# EAGLE design untitled2 (EAGLE 8.2.2)
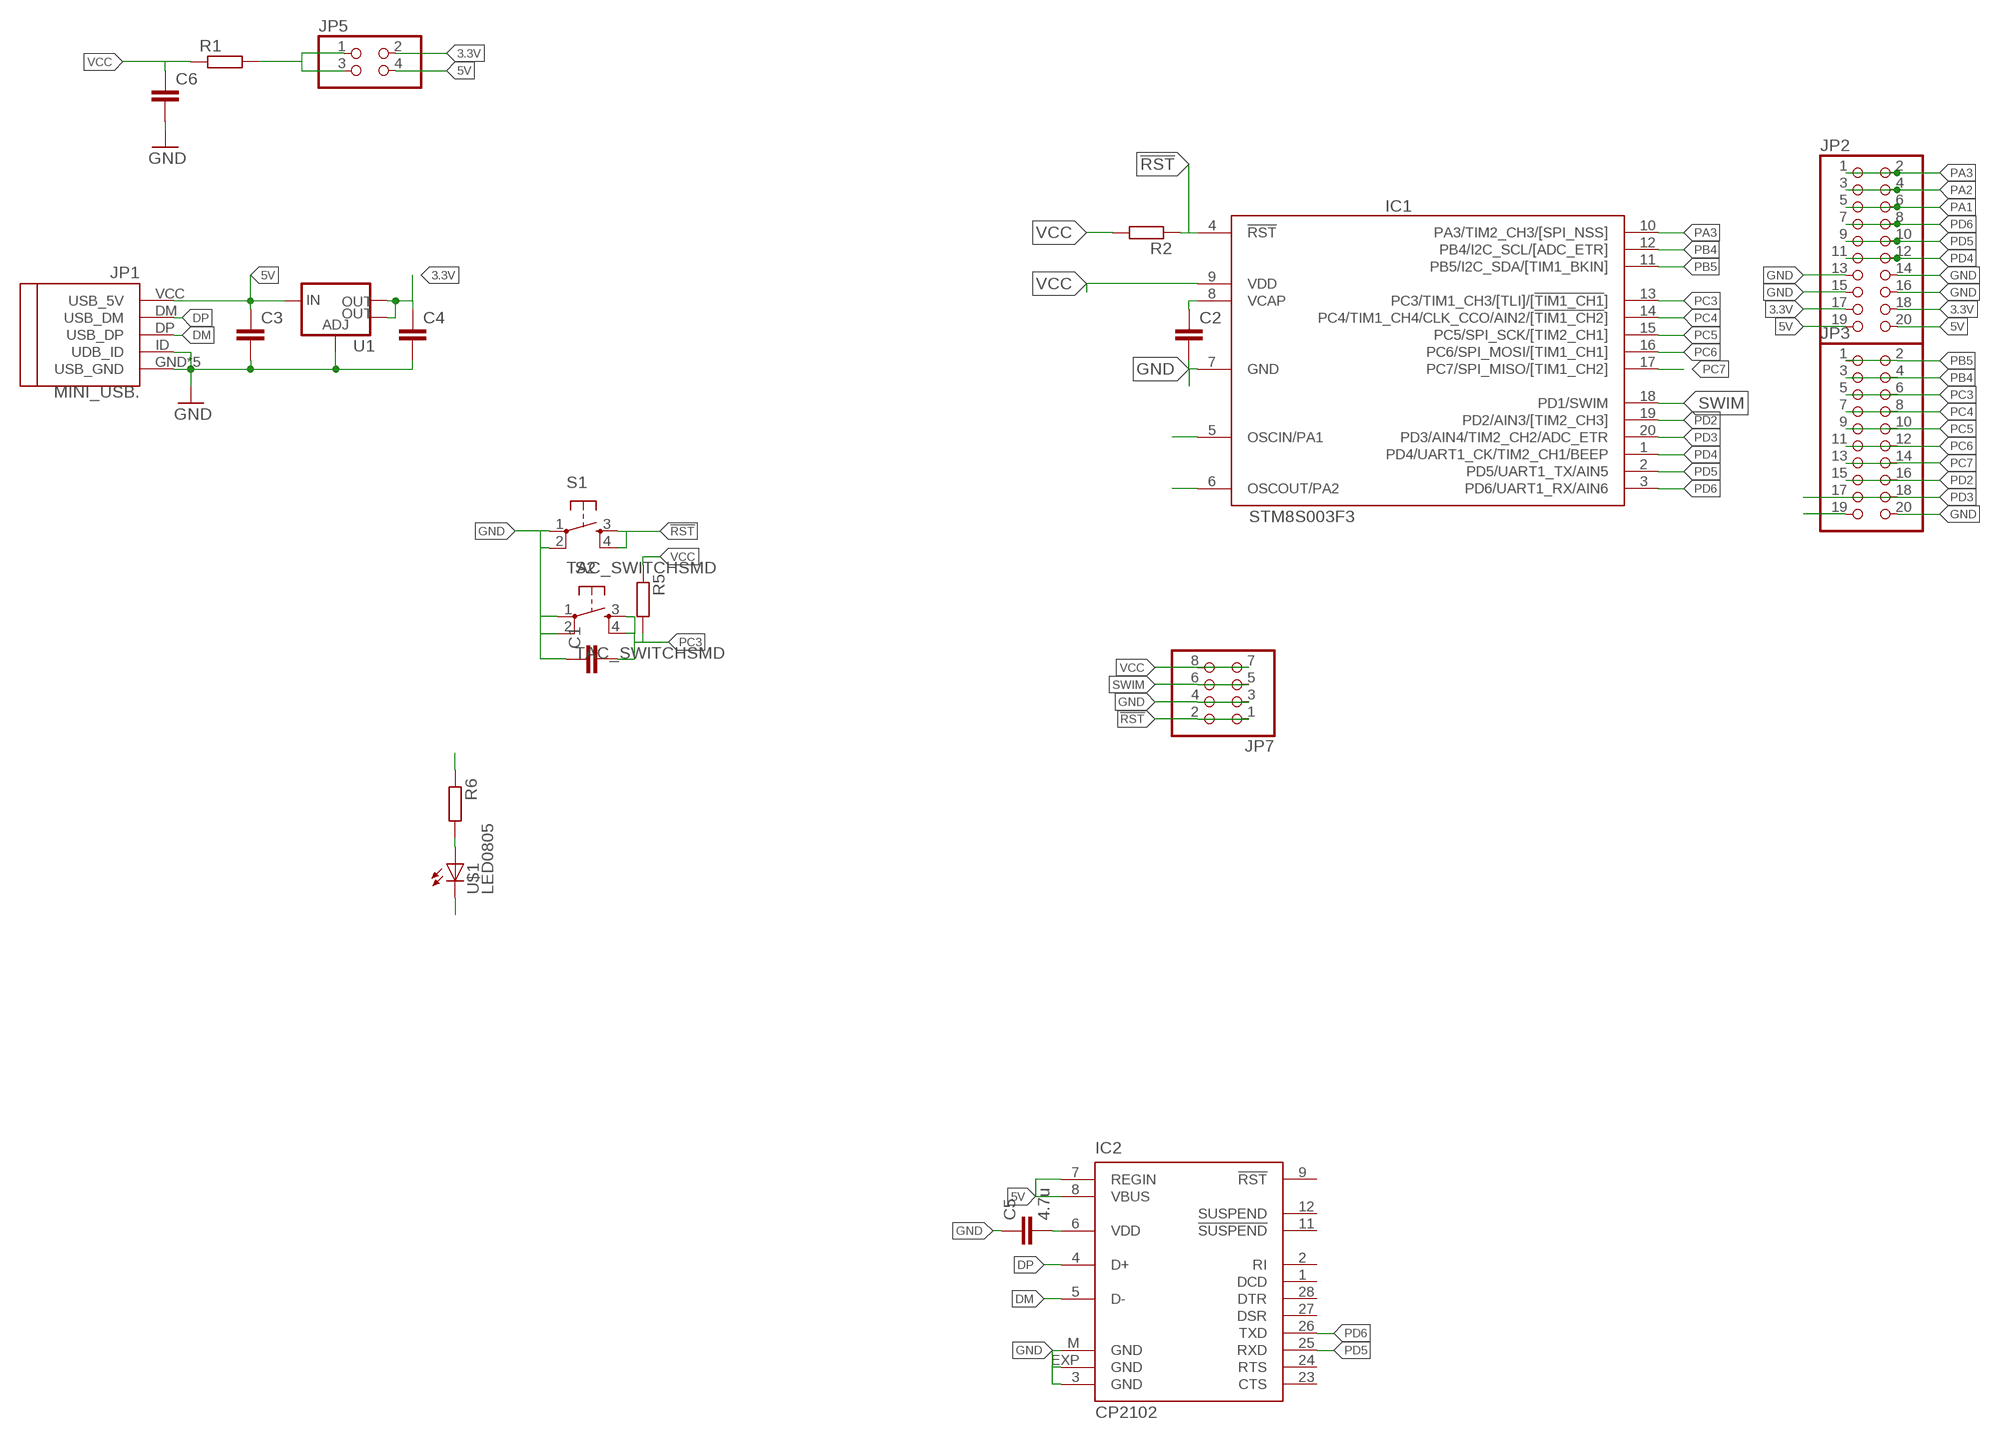
[diagram p0: schematic, sheet 1]

## Parts
C1  CC0805  [C0805]
C2  CC0603  [C0603]
C3  CC0805  [C0805]
C4  CC0805  [C0805]
C5  4.7u  CC0603  [C0603]
C6  CC0805  [C0805]
IC1  STM8S003F3  [TSSOP20]
IC2  CP2102  [MLP28]
JP1  MINI_USB.  [32005-201]
JP2  PINHD-2X10_2.54-SMD  [2X10SMD]
JP3  PINHD-2X10_2.54-SMD  [2X10SMD]
JP5  PINHD-2X02_2.54-SMD  [2X02SMD]
JP7  PINHD-2X04_2.54-SMD  [2X04SMD]
R1  R1206  [R1206]
R2  R0603  [0603]
R5  R0805  [R0805]
R6  R0805  [R0805]
S1  TAC_SWITCHSMD  [TACTILE-SWITCH-SMD]
S2  TAC_SWITCHSMD  [TACTILE-SWITCH-SMD]
U1  V_REG_LM1117SOT223  [SOT223]
U$1  LED0805  [0805-LED]

## Nets
3.3V: C4.1 JP2.17 JP2.18 JP5.2 U1.2(OUT) U1.4(OUT)
5V: C3.1 IC2.7(REGIN) IC2.8(VBUS) JP1.VCC(USB_5V) JP2.19 JP2.20 JP5.4 U1.3(IN)
!RST: IC1.4(!RST) JP7.1 JP7.2 R2.1 S1.3 S1.4
DM: IC2.5(D-) JP1.DP(USB_DP)
DP: IC2.4(D+) JP1.DM(USB_DM)
GND: C1.1 C2.2 C3.2 C4.2 C5.1 C6.2 IC1.7(GND) IC2.3(GND) IC2.EXP(GND) IC2.M(GND) JP1.GND(USB_GND) JP1.ID(UDB_ID) JP1.M1(USB_GND) JP1.M2(USB_GND) JP1.M3(USB_GND) JP1.M4(USB_GND) JP2.13 JP2.14 JP2.15 JP2.16 JP3.19 JP3.20 JP7.3 JP7.4 S1.1 S1.2 S2.1 S2.2 U1.1(ADJ) U$1.C
INTVDD: C5.2 IC2.6(VDD)
N$2: C2.1 IC1.8(VCAP)
N$7: R6.2 U$1.A
PA1: IC1.5(OSCIN/PA1) JP2.5 JP2.6
PA2: IC1.6(OSCOUT/PA2) JP2.3 JP2.4
PA3: IC1.10(PA3/TIM2_CH3/[SPI_NSS]) JP2.1 JP2.2
PB4: IC1.12(PB4/I2C_SCL/[ADC_ETR]) JP3.3 JP3.4
PB5: IC1.11(PB5/I2C_SDA/[TIM1_BKIN]) JP3.1 JP3.2
PC3: C1.2 IC1.13(PC3/TIM1_CH3/[TLI]/[!TIM1_CH1!]) JP3.5 JP3.6 R5.2 S2.3 S2.4
PC4: IC1.14(PC4/TIM1_CH4/CLK_CCO/AIN2/[!TIM1_CH2!]) JP3.7 JP3.8
PC5: IC1.15(PC5/SPI_SCK/[TIM2_CH1]) JP3.9 JP3.10
PC6: IC1.16(PC6/SPI_MOSI/[TIM1_CH1]) JP3.11 JP3.12
PC7: IC1.17(PC7/SPI_MISO/[TIM1_CH2]) JP3.13 JP3.14
PD2: IC1.19(PD2/AIN3/[TIM2_CH3]) JP3.15 JP3.16
PD3: IC1.20(PD3/AIN4/TIM2_CH2/ADC_ETR) JP3.17 JP3.18
PD4: IC1.1(PD4/UART1_CK/TIM2_CH1/BEEP) JP2.11 JP2.12
PD5: IC1.2(PD5/UART1_TX/AIN5) IC2.25(RXD) JP2.9 JP2.10
PD6: IC1.3(PD6/UART1_RX/AIN6) IC2.26(TXD) JP2.7 JP2.8
SWIM: IC1.18(PD1/SWIM) JP7.5 JP7.6
VCC: C6.1 IC1.9(VDD) JP5.1 JP5.3 JP7.7 JP7.8 R1.1 R1.2 R2.2 R5.1 R6.1
Unconnected: IC2.1(DCD) IC2.2(RI) IC2.9(!RST) IC2.11(!SUSPEND) IC2.12(SUSPEND) IC2.23(CTS) IC2.24(RTS) IC2.27(DSR) IC2.28(DTR)

## Library data of the parts
C1-C6 = CasaLibrary:C: Capacitor
IC1 = CasaLibrary:STM8S003: Value line, 16 MHz STM8S 8-bit MCU, 8 Kbytes Flash, 128 bytes data EEPROM, 10-bit ADC, 3 timers, UART, SPI, I2C
IC2 = silabs:CP210*: Single-Chip USB to UART Bridge Source: www.silabs.com .. CP2101.pdf / cp2102.pdf; MF: FARNELL; MPN: CP2102-GM; OC_FARNELL: 9282130; OC_NEWARK: 30K5635
JP1 = connectors:MINI_USB
JP2 JP3 = pinhead-2:PINHD-2X10: PIN HEADER
JP5 = pinhead-2:PINHD-2X02: PIN HEADER
JP7 = pinhead-2:PINHD-2X04: PIN HEADER
R1 R2 R5 R6 = CasaLibrary:R
S1 S2 = SparkFun-Retired:TAC_SWITCH: Momentary Switch Button commonly used for reset or general input. Spark Fun Electronics SKU : COM-00097 SMT- SWCH-08247; PROD_ID: SWCH-08247
U1 = CasaLibrary:V_REG_LM1117: Voltage Regulator LM1117 Standard adjustable voltage regulator but in SMD form. Spark Fun Electronics SKU : COM-00595; PROD_ID: VREG-08170
U$1 = CasaLibrary:LED

## Board
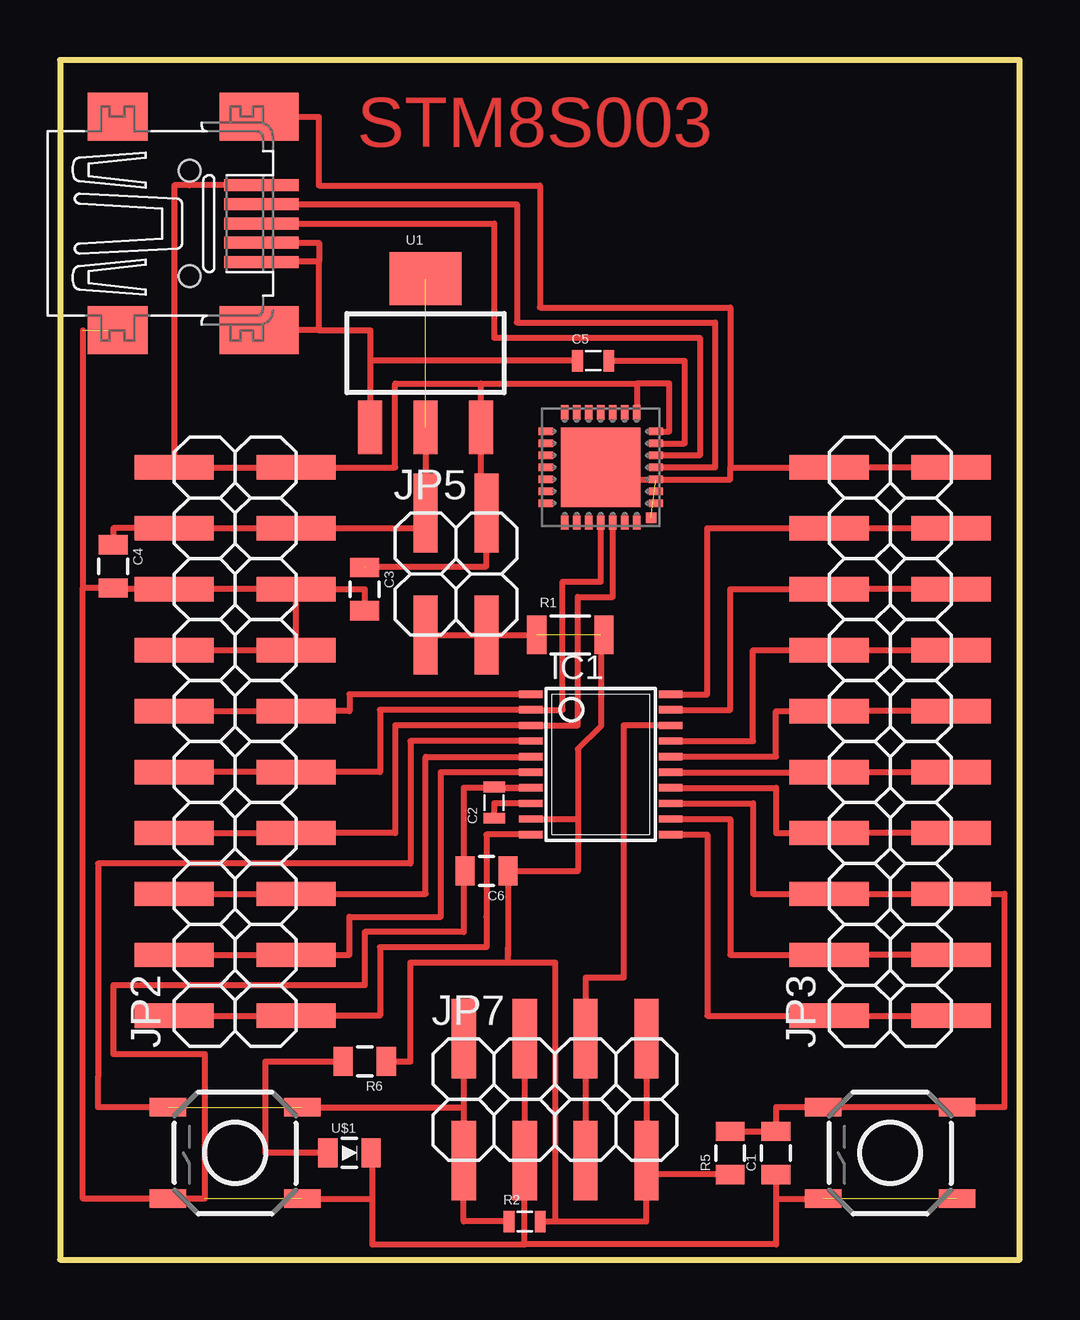
[diagram p1: board, top side]

Size 40 x 50 mm. Coordinates in mm from the lower left corner, seen from the top.
Outline: 0,0 40,0 40,50 0,50 0,0
Copper layers (1*16): Top 0.035mm / dielectric 1.5mm / Bottom 0.035mm
Design rules "default *": minimum track width 0.2mm, minimum drill 0.2mm, track to track 0.25mm, track to pad 0.25mm, pad to pad 0.25mm, via to via 0.25mm, smd to smd 0.2mm, copper to edge 0.2mm, drill to drill 0.2mm, minimum pad ring 10mil, minimum via ring 8mil, stop-mask expansion 4mil, vias tented up to drill 0mil, thermal gap 10mil

### Footprints (pad centres in the part's own frame; a part is rotated, then mirrored left to right if it is on the bottom)
C0805 = smd 0.8 x 1.2: 1 -0.9,0; 2 0.9,0
C0603 = smd 0.45 x 0.9: 1 -0.65,0; 2 0.65,0
TSSOP20 = smd 0.305 x 0.991: 1 -2.925,-2.918; 2 -2.275,-2.918; 3 -1.625,-2.918; 4 -0.975,-2.918; 5 -0.325,-2.918; 6 0.325,-2.918; 7 0.975,-2.918; 8 1.625,-2.918; 9 2.275,-2.918; 10 2.925,-2.918; 11 2.925,2.918; 12 2.275,2.918; 13 1.625,2.918; 14 0.975,2.918; 15 0.325,2.918; 16 -0.325,2.918; 17 -0.975,2.918; 18 -1.625,2.918; 19 -2.275,2.918; 20 -2.925,2.918
MLP28 = smd 0.6 x 0.3: 1 -2.3,1.5; 2 -2.3,1; 3 -2.3,0.5; 4 -2.3,0; 5 -2.3,-0.5; 6 -2.3,-1; 7 -2.3,-1.5; 15 2.3,-1.5; 16 2.3,-1; 17 2.3,-0.5; 18 2.3,0; 19 2.3,0.5; 20 2.3,1; 21 2.3,1.5 | smd 0.3 x 0.6: 8 -1.5,-2.3; 9 -1,-2.3; 10 -0.5,-2.3; 11 0,-2.3; 12 0.5,-2.3; 13 1,-2.3; 14 1.5,-2.3; 22 1.5,2.3; 23 1,2.3; 24 0.5,2.3; 25 0,2.3; 26 -0.5,2.3; 27 -1,2.3; 28 -1.5,2.3 | smd 3.3 x 3.3: EXP 0,0 | smd 0.435 x 0.435: M -2.103,2.103
32005-201 = smd 3.1 x 0.5: DM 3,0.8; DP 3,0; GND 3,-1.6; ID 3,-0.8; VCC 3,1.6 | smd 2.5 x 2: M1 -3,-4.45; M2 -3,4.45 | smd 3.3 x 2: M3 2.9,4.45; M4 2.9,-4.45 | hole 0.9: 0,2.2; 0,-2.2
2X10SMD = smd 1.016 x 3.302: 1 -1.27,-3.81; 2 -1.27,1.27; 3 1.27,-3.81; 4 1.27,1.27; 5 3.81,-3.81; 6 3.81,1.27; 7 6.35,-3.81; 8 6.35,1.27; 9 8.89,-3.81; 10 8.89,1.27; 11 11.43,-3.81; 12 11.43,1.27; 13 13.97,-3.81; 14 13.97,1.27; 15 16.51,-3.81; 16 16.51,1.27; 17 19.05,-3.81; 18 19.05,1.27; 19 21.59,-3.81; 20 21.59,1.27
2X02SMD = smd 1.016 x 3.302: 1 -1.27,-3.81; 2 -1.27,1.27; 3 1.27,-3.81; 4 1.27,1.27
2X04SMD = smd 1.016 x 3.302: 1 -1.27,-3.81; 2 -1.27,1.27; 3 1.27,-3.81; 4 1.27,1.27; 5 3.81,-3.81; 6 3.81,1.27; 7 6.35,-3.81; 8 6.35,1.27
R1206 = smd 0.8 x 1.6: 1 -1.4,0; 2 1.4,0
0603 = smd 0.45 x 0.9: 1 -0.65,0; 2 0.65,0
R0805 = smd 0.8 x 1.2: 1 -0.9,0; 2 0.9,0
TACTILE-SWITCH-SMD = smd 1.524 x 0.762: 1 -2.794,1.905; 2 2.794,1.905; 3 -2.794,-1.905; 4 2.794,-1.905
SOT223 = smd 1 x 2.235: 1 -2.311,-3.099; 2 0,-3.099; 3 2.311,-3.099 | smd 3 x 2.2: 4 0,3.099
0805-LED = smd 0.8 x 1.2: A -0.9,0; C 0.9,0

### Placement (x,y rotation side)
C1  29.84,4.45 90 top
C2  18.1,19.05 90 top
C3  12.7,27.94 270 top
C4  2.22,28.89 270 top
C5  22.23,37.47 0 top
C6  17.78,16.19 180 top
IC1  22.54,20.64 270 top
IC2  22.54,33.02 180 top
JP1  5.4,43.18 0 top
JP2  6.03,11.43 90 top
JP3  33.34,11.43 90 top
JP5  16.51,29.84 0 top
JP7  18.1,7.94 0 top
R1  21.27,26.04 0 top
R2  19.37,1.59 0 top
R5  27.94,4.45 90 top
R6  12.7,8.26 180 top
S1  7.3,4.45 180 top
S2  34.61,4.45 180 top
U1  15.24,37.78 0 top
U$1  12.06,4.45 0 top

### Tracks (layer width: path | path; a pad name or v marks a point on that pad's centre or on a via)
3.3V  (1 unrouted)
  Top 0.254: C4.1 2.22,30.48 JP2.18 JP2.17 15.24,30.48 JP5.2 U1.2
5V  (1 unrouted)
  Top 0.254: JP1.VCC 5.4,44.78 4.76,44.78 JP2.20 JP2.19 13.97,33.02 13.97,36.51 17.55,36.51 | IC2.7 25.4,34.52 25.4,36.51 24.04,36.51 | 24.04,36.51 IC2.8 | 12.7,28.89 17.78,28.89 JP5.4 17.55,31.11 U1.3 17.55,36.51 | 17.55,36.51 24.04,36.51
!RST  (1 unrouted)
  Top 0.254: IC1.4 14.61,21.61 14.61,16.51 1.59,16.51 1.59,7.62 1.59,6.35 S1.4 | S1.3 16.83,6.35 JP7.2 JP7.1 16.83,1.59 R2.1
DM
  Top 0.254: JP1.DP 18.1,43.18 18.1,38.42 26.67,38.42 26.67,33.52 IC2.5
DP
  Top 0.254: IC2.4 27.3,33.02 27.3,39.05 19.05,39.05 19.05,43.98 JP1.DM
GND  (4 unrouted)
  Top 0.254: JP2.14 JP2.13 JP2.15 | JP2.15 JP2.16 2.22,27.94 C4.2 0.95,27.99 | JP2.15 12.7,27.94 C3.2 | 10.79,38.73 JP1.M4 | JP1.ID 10.79,42.38 10.79,41.59 | 10.79,41.59 8.4,41.59 JP1.GND | 10.79,38.73 10.79,41.59 | 0.95,38.73 0.95,27.99 | 10.16,2.54 S1.1 13.02,2.54 | 0.95,27.99 0.95,2.54 S1.2 6.03,2.54 6.03,8.57 2.22,8.57 2.22,11.43 12.7,11.43 12.7,13.65 16.83,13.65 16.83,16.19 | C1.1 29.84,2.54 | 29.84,2.54 S2.2 | 9.53,47.31 9.53,47.63 JP1.M3 10.79,47.62 10.79,44.77 20,44.77 20,39.69 27.94,39.69 27.94,33.02 | C2.2 18.14,19.66 IC1.7 16.83,19.66 16.83,16.19 | C5.1 12.93,37.47 | 12.93,37.47 U1.1 | 10.79,38.73 12.93,38.73 12.93,37.47 | 23.81,32.38 23.81,33.02 IC2.EXP 22.54,32.52 IC2.3 27.94,32.52 27.94,33.02 | C6.2 16.83,16.19 | JP7.4 JP7.3 | 29.84,2.54 29.84,0.64 19.37,0.64 | 19.37,0.64 JP7.3 | 13.02,2.54 13.02,0.64 19.37,0.64 | 19.37,2.54 JP7.3 | U$1.C 13.02,4.45 13.02,2.54 | JP3.19 JP3.20 27.94,33.02
INTVDD
  Top 0.254: IC2.6 26.04,34.02 26.04,37.47 C5.2
N$2
  Top 0.254: IC1.8 18.1,19.01 C2.1
N$7
  Top 0.254: U$1.A 8.57,4.45 8.57,8.26 R6.2
PA1
  Top 0.254: IC1.5 15.24,20.95 15.24,15.24 JP2.5 JP2.6
PA2
  Top 0.254: IC1.6 15.88,20.32 15.88,14.29 12.06,14.29 12.06,12.7 JP2.3 JP2.4
PA3
  Top 0.254: IC1.10 17.78,17.71 17.78,14.29 17.78,13.02 13.34,13.02 13.34,10.16 JP2.1 JP2.2
PB4
  Top 0.254: IC1.12 27.94,18.36 27.94,12.7 JP3.4 JP3.3
PB5
  Top 0.254: IC1.11 26.99,17.71 26.99,10.16 JP3.2 JP3.1
PC3
  Top 0.254: IC1.13 28.89,19.01 28.89,15.24 JP3.6 | JP3.6 JP3.5 | JP3.6 39.37,15.24 39.37,6.35 S2.3 S2.4 29.84,6.35 C1.2 R5.2
PC4
  Top 0.254: IC1.14 29.84,19.66 29.84,17.78 JP3.8 JP3.7
PC5
  Top 0.254: IC1.15 JP3.10 JP3.9
PC6
  Top 0.254: IC1.16 29.84,20.96 29.84,22.86 JP3.12 JP3.11
PC7
  Top 0.254: IC1.17 28.89,21.61 28.89,25.4 JP3.14 JP3.13
PD2
  Top 0.254: IC1.19 27.94,22.91 27.94,27.94 JP3.16 JP3.15
PD3
  Top 0.254: IC1.20 26.99,23.56 26.99,30.48 JP3.18 JP3.17
PD4
  Top 0.254: IC1.1 12.06,23.56 12.06,22.86 JP2.11 JP2.12
PD5
  Top 0.254: JP2.10 JP2.9 13.34,20.32 13.34,22.91 IC1.2 20.95,22.91 20.95,28.26 22.54,28.26 IC2.25
PD6
  Top 0.254: JP2.8 JP2.7 13.97,17.78 13.97,22.26 IC1.3 21.59,22.26 21.59,27.62 23.04,27.62 IC2.26
SWIM
  Top 0.254: JP7.6 JP7.5 | IC1.18 23.5,22.26 23.5,11.75 21.91,11.75 JP7.6 | 21.91,9.84 JP7.6
VCC  (1 unrouted)
  Top 0.254: IC1.9 21.59,18.36 | 21.59,18.36 21.59,16.19 C6.1 18.68,13.02 | JP5.3 JP5.1 R1.1 | R1.2 22.54,26.04 22.54,22.23 21.59,21.27 21.59,18.36 | 18.68,13.02 18.68,12.7 | JP7.7 JP7.8 24.39,7.62 | R5.1 24.45,3.54 JP7.7 | 18.68,12.38 14.61,12.38 14.61,8.26 R6.1 | 18.68,12.38 18.68,13.02 | 18.68,12.38 20.64,12.38 20.64,1.59 | 20.64,1.59 24.45,1.59 JP7.7 | R2.2 20.64,1.59

### Text on the board
Top: STM8S003